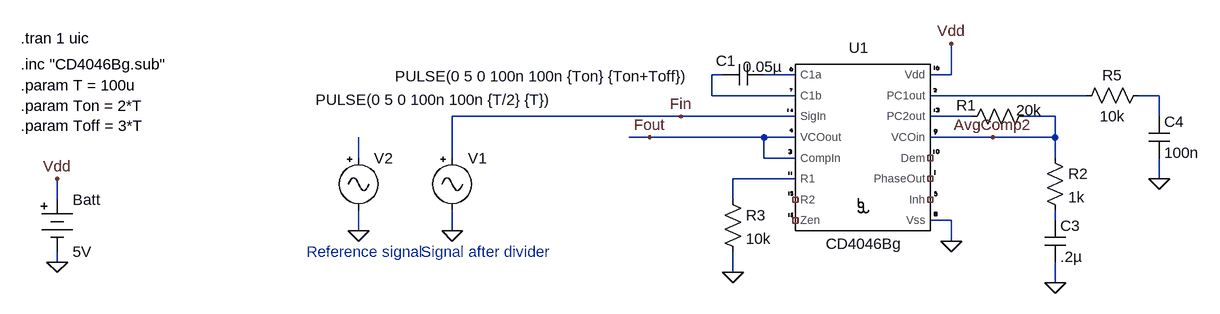
[diagram p0: schematic inexact-divider.asc]
inexact-divider.asc, the LTspice schematic file:
Version 4
SHEET 1 908 680
WIRE 0 64 -16 64
WIRE 112 64 64 64
WIRE 352 64 352 16
WIRE 352 64 320 64
WIRE -16 96 -16 64
WIRE 112 96 -16 96
WIRE 560 96 320 96
WIRE 672 96 640 96
WIRE -64 128 -416 128
WIRE 112 128 -64 128
WIRE 384 128 320 128
WIRE 512 128 464 128
WIRE 672 128 672 96
WIRE -112 160 -144 160
WIRE 64 160 -112 160
WIRE 112 160 64 160
WIRE 416 160 320 160
WIRE 512 160 512 128
WIRE 512 160 416 160
WIRE -560 192 -560 160
WIRE -416 192 -416 128
WIRE 64 192 64 160
WIRE 112 192 64 192
WIRE 512 192 512 160
WIRE 112 224 16 224
WIRE 672 224 672 192
WIRE -1024 256 -1024 224
WIRE 16 256 16 224
WIRE 352 288 320 288
WIRE 512 288 512 272
WIRE -560 304 -560 272
WIRE -416 304 -416 272
WIRE 352 320 352 288
WIRE -1024 352 -1024 336
WIRE 16 368 16 336
WIRE 512 384 512 352
FLAG -1024 352 0
FLAG -1024 224 Vdd
FLAG 352 320 0
FLAG 352 16 Vdd
FLAG 512 384 0
FLAG 16 368 0
FLAG 672 224 0
FLAG 416 160 AvgComp2
FLAG -112 160 Fout
FLAG -64 128 Fin
FLAG -416 304 0
FLAG -560 304 0
SYMBOL CD4046Bg 224 208 R0
SYMATTR InstName U1
SYMBOL cap 0 80 R270
WINDOW 0 22 5 VTop 2
WINDOW 3 44 62 VBottom 2
SYMATTR InstName C1
SYMATTR Value 0.05µ
SYMBOL Misc\\battery -1024 240 R0
WINDOW 123 0 0 Left 2
WINDOW 39 0 0 Left 2
SYMATTR InstName Batt
SYMATTR Value 5V
SYMBOL res 0 240 R0
SYMATTR InstName R3
SYMATTR Value 10k
SYMBOL cap 496 288 R0
SYMATTR InstName C3
SYMATTR Value .2µ
SYMBOL res 480 112 R90
WINDOW 0 14 105 VBottom 2
WINDOW 3 -9 8 VTop 2
SYMATTR InstName R1
SYMATTR Value 20k
SYMBOL res 656 80 R90
WINDOW 0 0 56 VBottom 2
WINDOW 3 32 56 VTop 2
SYMATTR InstName R5
SYMATTR Value 10k
SYMBOL cap 656 128 R0
SYMATTR InstName C4
SYMATTR Value 100n
SYMBOL res 496 176 R0
SYMATTR InstName R2
SYMATTR Value 1k
SYMBOL Misc\\signal -416 176 R0
WINDOW 3 -88 -110 Left 2
WINDOW 123 0 0 Left 2
WINDOW 39 0 0 Left 2
SYMATTR Value PULSE(0 5 0 100n 100n {Ton} {Ton+Toff})
SYMATTR InstName V1
SYMBOL Misc\\signal -560 176 R0
WINDOW 3 -66 -74 Left 2
WINDOW 123 0 0 Left 2
WINDOW 39 0 0 Left 2
SYMATTR Value PULSE(0 5 0 100n 100n {T/2} {T})
SYMATTR InstName V2
TEXT -1080 8 Left 2 !.tran 1 uic
TEXT -1080 48 Left 2 !.inc "CD4046Bg.sub"
TEXT -1080 80 Left 2 !.param T = 100u\n.param Ton = 2*T\n.param Toff = 3*T
TEXT -640 336 Left 2 ;Reference signal
TEXT -464 336 Left 2 ;Signal after divider

The netlist it stands for:
* inexact-divider.asc
XU1 N002 N001 Fout NC_01 N007 NC_02 Fin AvgComp2 Vdd 0 NC_03 N003 N005 NC_04 Fout NC_05 CD4046Bg  ; pins C1a C1b CompIn Inh R1 R2 SigIn VCOin Vdd Vss Dem PC1out PC2out PhaseOut VCOout Zen
C1 N001 N002 0.05µ
V§Batt Vdd 0 5V
R3 N007 0 10k
C3 N008 0 .2µ
R1 AvgComp2 N005 20k
R5 N004 N003 10k
C4 N004 0 100n
R2 AvgComp2 N008 1k
V1 Fin 0 PULSE(0 5 0 100n 100n {Ton} {Ton+Toff})
V2 N006 0 PULSE(0 5 0 100n 100n {T/2} {T})
.tran 1 uic
.inc "CD4046Bg.sub"
.param T = 100u
.param Ton = 2*T
.param Toff = 3*T
* Reference signal
* Signal after divider
.backanno
.end